# Altium schematic sheet 02_Overview.SchDoc
size A4; SheetNumber: 2; SheetTotal: 5
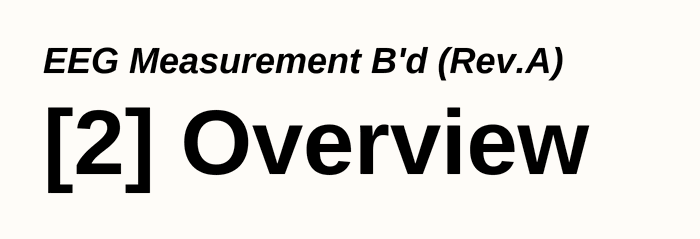
[diagram p0: 02_Overview.SchDoc]

## Notes on the sheet
- EEG Measurement B'd (Rev.A)
- [2] Overview